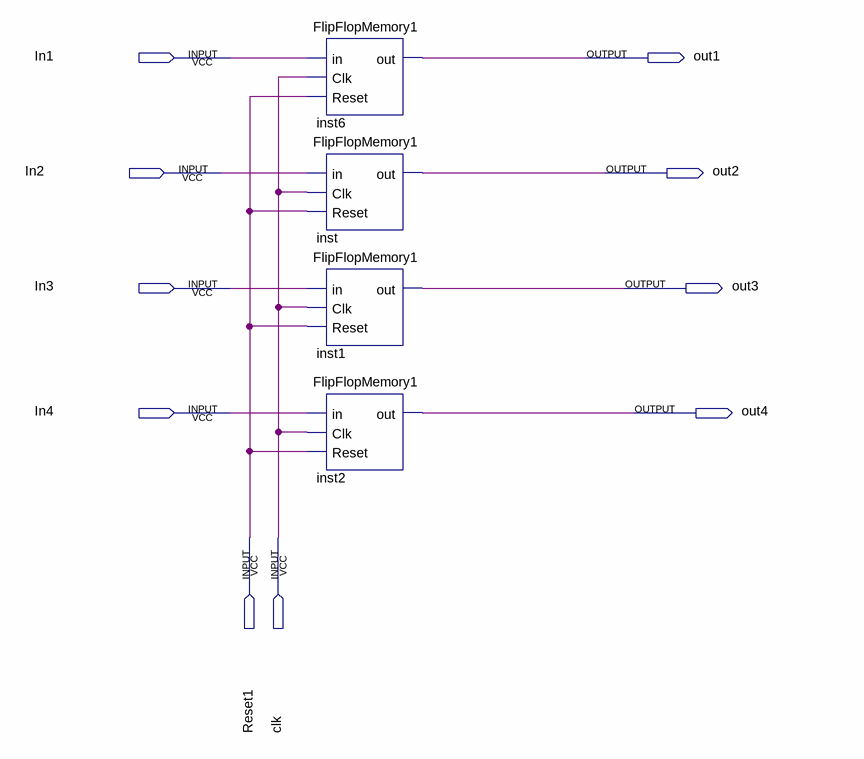
[diagram p0: schematic sheet]
// Quartus schematic FourFPPS.bdf as structural Verilog: 4 symbols, 10 pins
module FourFPPS (
  input  In1,
  input  In2,
  input  In3,
  input  In4,
  input  Reset1,
  input  clk,
  output out1,
  output out2,
  output out3,
  output out4
);

  FlipFlopMemory1 inst6 (.in(In1), .Clk(clk), .Reset(Reset1), .out(out1));
  FlipFlopMemory1 inst (.in(In2), .Clk(clk), .Reset(Reset1), .out(out2));
  FlipFlopMemory1 inst1 (.in(In3), .Clk(clk), .Reset(Reset1), .out(out3));
  FlipFlopMemory1 inst2 (.in(In4), .Clk(clk), .Reset(Reset1), .out(out4));
endmodule
